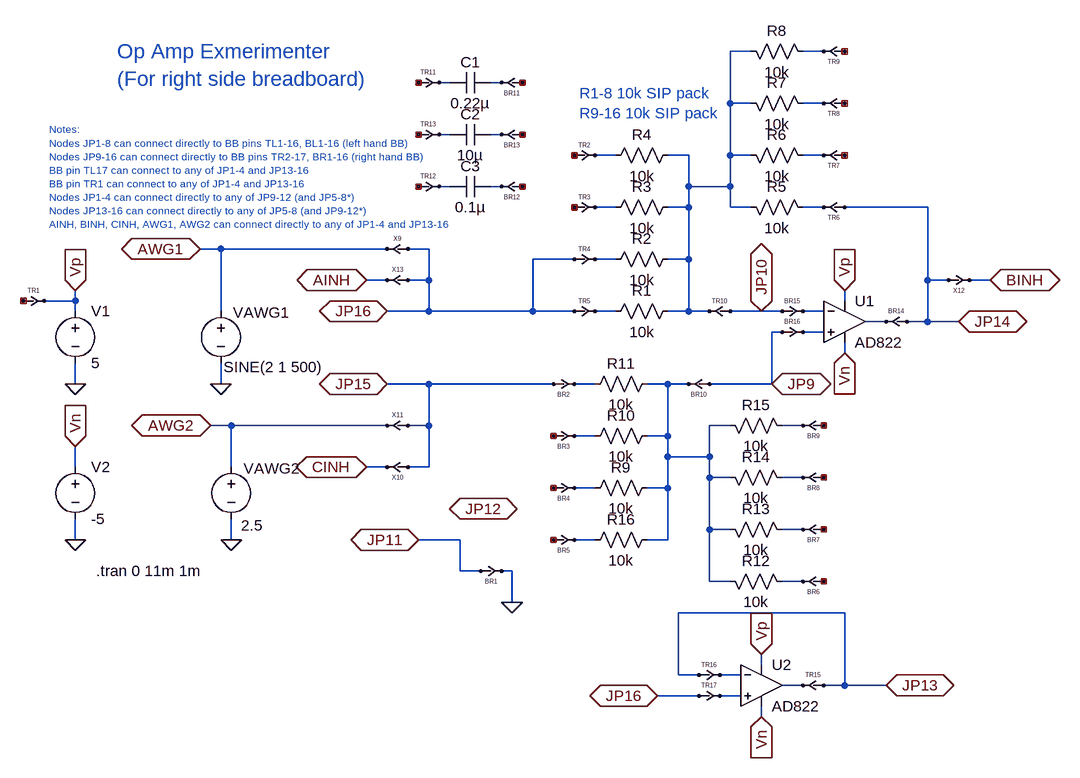
[diagram p0: schematic op_amp_experimenter.asc]
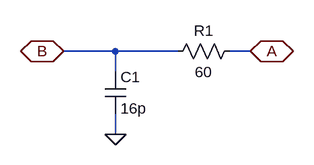
[diagram p1: sub-circuit cross_point.asc]
op_amp_experimenter.asc, the LTspice schematic file:
Version 4
SHEET 1 1668 1532
WIRE -720 416 -752 416
WIRE -608 416 -640 416
WIRE -1184 464 -1200 464
WIRE -1104 464 -1120 464
WIRE -752 496 -752 416
WIRE -720 496 -752 496
WIRE -608 496 -640 496
WIRE -1184 544 -1200 544
WIRE -1104 544 -1120 544
WIRE -928 576 -960 576
WIRE -816 576 -848 576
WIRE -752 576 -752 496
WIRE -720 576 -752 576
WIRE -608 576 -640 576
WIRE -1184 624 -1200 624
WIRE -1104 624 -1120 624
WIRE -816 624 -816 576
WIRE -752 624 -752 576
WIRE -752 624 -816 624
WIRE -928 656 -960 656
WIRE -816 656 -816 624
WIRE -816 656 -848 656
WIRE -752 656 -752 624
WIRE -720 656 -752 656
WIRE -608 656 -640 656
WIRE -448 656 -576 656
WIRE -1536 720 -1568 720
WIRE -1280 720 -1536 720
WIRE -1216 720 -1248 720
WIRE -992 736 -1056 736
WIRE -928 736 -960 736
WIRE -816 736 -816 656
WIRE -816 736 -848 736
WIRE -1280 768 -1312 768
WIRE -1216 768 -1216 720
WIRE -1216 768 -1248 768
WIRE -448 768 -448 656
WIRE -416 768 -448 768
WIRE -352 768 -384 768
WIRE -1760 800 -1760 784
WIRE -1760 800 -1808 800
WIRE -576 800 -576 784
WIRE -1760 816 -1760 800
WIRE -1536 816 -1536 720
WIRE -1216 816 -1216 768
WIRE -1216 816 -1280 816
WIRE -1056 816 -1056 736
WIRE -1056 816 -1216 816
WIRE -992 816 -1056 816
WIRE -928 816 -960 816
WIRE -816 816 -816 736
WIRE -816 816 -848 816
WIRE -784 816 -816 816
WIRE -704 816 -752 816
WIRE -672 816 -704 816
WIRE -608 816 -640 816
WIRE -512 832 -544 832
WIRE -448 832 -448 768
WIRE -448 832 -480 832
WIRE -400 832 -448 832
WIRE -672 848 -688 848
WIRE -608 848 -640 848
WIRE -576 880 -576 864
WIRE -1760 928 -1760 896
WIRE -1536 928 -1536 896
WIRE -1216 928 -1280 928
WIRE -1024 928 -1216 928
WIRE -960 928 -992 928
WIRE -848 928 -880 928
WIRE -816 928 -848 928
WIRE -688 928 -688 848
WIRE -688 928 -784 928
WIRE -1520 992 -1552 992
WIRE -1280 992 -1520 992
WIRE -1216 992 -1216 928
WIRE -1216 992 -1248 992
WIRE -752 992 -784 992
WIRE -640 992 -672 992
WIRE -960 1008 -992 1008
WIRE -848 1008 -848 928
WIRE -848 1008 -880 1008
WIRE -848 1040 -848 1008
WIRE -784 1040 -784 992
WIRE -784 1040 -848 1040
WIRE -1760 1056 -1760 1024
WIRE -1520 1056 -1520 992
WIRE -1280 1056 -1312 1056
WIRE -1216 1056 -1216 992
WIRE -1216 1056 -1248 1056
WIRE -784 1072 -784 1040
WIRE -752 1072 -784 1072
WIRE -640 1072 -672 1072
WIRE -960 1088 -992 1088
WIRE -848 1088 -848 1040
WIRE -848 1088 -880 1088
WIRE -784 1152 -784 1072
WIRE -752 1152 -784 1152
WIRE -640 1152 -672 1152
WIRE -1760 1168 -1760 1136
WIRE -1520 1168 -1520 1136
WIRE -1168 1168 -1232 1168
WIRE -960 1168 -992 1168
WIRE -848 1168 -848 1088
WIRE -848 1168 -880 1168
WIRE -1168 1216 -1168 1168
WIRE -1136 1216 -1168 1216
WIRE -1088 1216 -1104 1216
WIRE -784 1232 -784 1152
WIRE -752 1232 -784 1232
WIRE -640 1232 -672 1232
WIRE -1088 1264 -1088 1216
WIRE -576 1280 -832 1280
WIRE -704 1360 -704 1344
WIRE -832 1376 -832 1280
WIRE -800 1376 -832 1376
WIRE -736 1376 -768 1376
WIRE -640 1392 -672 1392
WIRE -576 1392 -576 1280
WIRE -576 1392 -608 1392
WIRE -512 1392 -576 1392
WIRE -800 1408 -864 1408
WIRE -736 1408 -768 1408
WIRE -704 1440 -704 1424
FLAG -512 1392 JP13
IOPIN -512 1392 BiDir
FLAG -864 1408 JP16
IOPIN -864 1408 BiDir
FLAG -400 832 JP14
IOPIN -400 832 BiDir
FLAG -1280 928 JP15
IOPIN -1280 928 BiDir
FLAG -688 928 JP9
IOPIN -688 928 BiDir
FLAG -704 816 JP10
IOPIN -704 816 BiDir
FLAG -1280 816 JP16
IOPIN -1280 816 BiDir
FLAG -1232 1168 JP11
IOPIN -1232 1168 BiDir
FLAG -1184 1120 JP12
IOPIN -1184 1120 BiDir
FLAG -1568 720 AWG1
IOPIN -1568 720 BiDir
FLAG -1312 1056 CINH
IOPIN -1312 1056 BiDir
FLAG -1552 992 AWG2
IOPIN -1552 992 BiDir
FLAG -352 768 BINH
IOPIN -352 768 BiDir
FLAG -1312 768 AINH
IOPIN -1312 768 BiDir
FLAG -1088 1264 0
FLAG -1760 928 0
FLAG -1760 1168 0
FLAG -1760 784 Vp
IOPIN -1760 784 In
FLAG -1760 1024 Vn
IOPIN -1760 1024 In
FLAG -704 1440 Vn
IOPIN -704 1440 In
FLAG -576 880 Vn
IOPIN -576 880 In
FLAG -704 1344 Vp
IOPIN -704 1344 In
FLAG -576 784 Vp
IOPIN -576 784 In
FLAG -1536 928 0
FLAG -1520 1168 0
SYMBOL cross_point -624 1392 R0
SYMATTR InstName TR15
SYMBOL cross_point -496 832 R0
SYMATTR InstName BR14
SYMBOL cross_point -784 1376 M0
SYMATTR InstName TR16
SYMBOL cross_point -784 1408 M0
SYMATTR InstName TR17
SYMBOL cross_point -656 816 M0
SYMATTR InstName BR15
SYMBOL cross_point -656 848 M0
SYMATTR InstName BR16
SYMBOL cross_point -1264 720 R0
SYMATTR InstName X9
SYMBOL cross_point -1264 1056 M180
SYMATTR InstName X10
SYMBOL cross_point -1264 992 R0
SYMATTR InstName X11
SYMBOL cross_point -400 768 R180
SYMATTR InstName X12
SYMBOL cross_point -1264 768 R0
SYMATTR InstName X13
SYMBOL res -832 800 R90
WINDOW 0 0 56 VBottom 2
WINDOW 3 32 56 VTop 2
SYMATTR InstName R1
SYMATTR Value 10k
SYMBOL res -832 720 R90
WINDOW 0 0 56 VBottom 2
WINDOW 3 32 56 VTop 2
SYMATTR InstName R2
SYMATTR Value 10k
SYMBOL res -832 640 R90
WINDOW 0 0 56 VBottom 2
WINDOW 3 32 56 VTop 2
SYMATTR InstName R3
SYMATTR Value 10k
SYMBOL res -832 560 R90
WINDOW 0 0 56 VBottom 2
WINDOW 3 32 56 VTop 2
SYMATTR InstName R4
SYMATTR Value 10k
SYMBOL res -736 640 M90
WINDOW 0 0 56 VBottom 2
WINDOW 3 32 56 VTop 2
SYMATTR InstName R5
SYMATTR Value 10k
SYMBOL res -736 560 M90
WINDOW 0 0 56 VBottom 2
WINDOW 3 32 56 VTop 2
SYMATTR InstName R6
SYMATTR Value 10k
SYMBOL res -736 480 M90
WINDOW 0 0 56 VBottom 2
WINDOW 3 32 56 VTop 2
SYMATTR InstName R7
SYMATTR Value 10k
SYMBOL res -736 400 M90
WINDOW 0 0 56 VBottom 2
WINDOW 3 32 56 VTop 2
SYMATTR InstName R8
SYMATTR Value 10k
SYMBOL cross_point -768 816 R0
SYMATTR InstName TR10
SYMBOL cross_point -976 576 M0
SYMATTR InstName TR2
SYMBOL cross_point -976 656 M0
SYMATTR InstName TR3
SYMBOL cross_point -976 736 M0
SYMATTR InstName TR4
SYMBOL cross_point -976 816 M0
SYMATTR InstName TR5
SYMBOL cross_point -592 656 M180
SYMATTR InstName TR6
SYMBOL cross_point -592 576 M180
SYMATTR InstName TR7
SYMBOL cross_point -592 496 M180
SYMATTR InstName TR8
SYMBOL cross_point -592 416 M180
SYMATTR InstName TR9
SYMBOL res -864 1072 R90
WINDOW 0 0 56 VBottom 2
WINDOW 3 32 56 VTop 2
SYMATTR InstName R9
SYMATTR Value 10k
SYMBOL res -864 992 R90
WINDOW 0 0 56 VBottom 2
WINDOW 3 32 56 VTop 2
SYMATTR InstName R10
SYMATTR Value 10k
SYMBOL res -864 912 R90
WINDOW 0 0 56 VBottom 2
WINDOW 3 32 56 VTop 2
SYMATTR InstName R11
SYMATTR Value 10k
SYMBOL res -768 1216 M90
WINDOW 0 0 56 VBottom 2
WINDOW 3 32 56 VTop 2
SYMATTR InstName R12
SYMATTR Value 10k
SYMBOL res -768 1136 M90
WINDOW 0 0 56 VBottom 2
WINDOW 3 32 56 VTop 2
SYMATTR InstName R13
SYMATTR Value 10k
SYMBOL res -768 1056 M90
WINDOW 0 0 56 VBottom 2
WINDOW 3 32 56 VTop 2
SYMATTR InstName R14
SYMATTR Value 10k
SYMBOL res -768 976 M90
WINDOW 0 0 56 VBottom 2
WINDOW 3 32 56 VTop 2
SYMATTR InstName R15
SYMATTR Value 10k
SYMBOL res -864 1152 R90
WINDOW 0 0 56 VBottom 2
WINDOW 3 32 56 VTop 2
SYMATTR InstName R16
SYMATTR Value 10k
SYMBOL cross_point -1120 1216 R180
SYMATTR InstName BR1
SYMBOL cross_point -1008 928 R180
SYMATTR InstName BR2
SYMBOL cross_point -1008 1008 R180
SYMATTR InstName BR3
SYMBOL cross_point -1008 1088 R180
SYMATTR InstName BR4
SYMBOL cross_point -1008 1168 R180
SYMATTR InstName BR5
SYMBOL cross_point -624 1232 M180
SYMATTR InstName BR6
SYMBOL cross_point -624 1152 M180
SYMATTR InstName BR7
SYMBOL cross_point -624 1072 M180
SYMATTR InstName BR8
SYMBOL cross_point -624 992 M180
SYMATTR InstName BR9
SYMBOL cross_point -800 928 M180
SYMATTR InstName BR10
SYMBOL cap -1120 448 R90
WINDOW 0 0 32 VBottom 2
WINDOW 3 32 32 VTop 2
SYMATTR InstName C1
SYMATTR Value 0.22µ
SYMBOL voltage -1760 800 R0
WINDOW 123 0 0 Left 0
WINDOW 39 0 0 Left 0
SYMATTR InstName V1
SYMATTR Value 5
SYMBOL voltage -1760 1040 R0
WINDOW 123 0 0 Left 0
WINDOW 39 0 0 Left 0
SYMATTR InstName V2
SYMATTR Value -5
SYMBOL voltage -1536 800 M0
WINDOW 123 0 0 Left 0
WINDOW 39 0 0 Left 0
WINDOW 0 -105 18 Left 2
WINDOW 3 -157 102 Left 2
SYMATTR InstName VAWG1
SYMATTR Value SINE(2 1 500)
SYMBOL voltage -1520 1040 M0
WINDOW 123 0 0 Left 0
WINDOW 39 0 0 Left 0
WINDOW 0 -105 18 Left 2
WINDOW 3 -49 106 Left 2
SYMATTR InstName VAWG2
SYMATTR Value 2.5
SYMBOL OpAmps\\AD822 -704 1328 R0
SYMATTR InstName U2
SYMBOL OpAmps\\AD822 -576 768 R0
SYMATTR InstName U1
SYMBOL cross_point -1216 464 M0
SYMATTR InstName TR11
SYMBOL cross_point -1088 464 M180
SYMATTR InstName BR11
SYMBOL cap -1120 528 R90
WINDOW 0 0 32 VBottom 2
WINDOW 3 32 32 VTop 2
SYMATTR InstName C2
SYMATTR Value 10µ
SYMBOL cross_point -1216 544 M0
SYMATTR InstName TR13
SYMBOL cross_point -1088 544 M180
SYMATTR InstName BR13
SYMBOL cap -1120 608 R90
WINDOW 0 0 32 VBottom 2
WINDOW 3 32 32 VTop 2
SYMATTR InstName C3
SYMATTR Value 0.1µ
SYMBOL cross_point -1216 624 M0
SYMATTR InstName TR12
SYMBOL cross_point -1088 624 M180
SYMATTR InstName BR12
SYMBOL cross_point -1824 800 M0
SYMATTR InstName TR1
TEXT -1728 1216 Left 2 !.tran 0 11m 1m
TEXT -1696 416 Left 3 ;Op Amp Exmerimenter\n(For right side breadboard)
TEXT -984 480 Left 2 ;R1-8 10k SIP pack\nR9-16 10k SIP pack
TEXT -1800 536 Left 1 ;Notes:\nNodes JP1-8 can connect directly to BB pins TL1-16, BL1-16 (left hand BB)\nNodes JP9-16 can connect directly to BB pins TR2-17, BR1-16 (right hand BB)\nBB pin TL17 can connect to any of JP1-4 and JP13-16\nBB pin TR1 can connect to any of JP1-4 and JP13-16\nNodes JP1-4 can connect directly to any of JP9-12 (and JP5-8*)\nNodes JP13-16 can connect directly to any of JP5-8 (and JP9-12*)\nAINH, BINH, CINH, AWG1, AWG2 can connect directly to any of JP1-4 and JP13-16

cross_point.asc, the sub-circuit schematic file:
Version 4
SHEET 1 880 680
WIRE 80 160 0 160
WIRE 176 160 80 160
WIRE 288 160 256 160
WIRE 80 192 80 160
WIRE 80 288 80 256
FLAG 288 160 A
IOPIN 288 160 BiDir
FLAG 0 160 B
IOPIN 0 160 BiDir
FLAG 80 288 0
SYMBOL res 272 144 R90
WINDOW 0 0 56 VBottom 2
WINDOW 3 32 56 VTop 2
SYMATTR InstName R1
SYMATTR Value 60
SYMBOL cap 64 192 R0
SYMATTR InstName C1
SYMATTR Value 16p

The netlist it stands for:
* op_amp_experimenter.asc
XTR15 JP13 N029 cross_point
XBR14 JP14 N017 cross_point
XTR16 JP13 N028 cross_point
XTR17 JP16 N030 cross_point
XBR15 JP10 N016 cross_point
XBR16 JP9 N018 cross_point
XX9 JP16 AWG1 cross_point
XX10 JP15 CINH cross_point
XX11 JP15 AWG2 cross_point
XX12 JP14 BINH cross_point
XX13 JP16 AINH cross_point
R1 N001 N015 10k
R2 N001 N014 10k
R3 N001 N012 10k
R4 N001 N008 10k
R5 N001 N013 10k
R6 N001 N009 10k
R7 N001 N005 10k
R8 N001 N002 10k
XTR10 JP10 N001 cross_point
XTR2 NC_01 N008 cross_point
XTR3 NC_02 N012 cross_point
XTR4 JP16 N014 cross_point
XTR5 JP16 N015 cross_point
XTR6 JP14 N013 cross_point
XTR7 NC_03 N009 cross_point
XTR8 NC_04 N005 cross_point
XTR9 NC_05 N002 cross_point
R9 N020 N024 10k
R10 N020 N022 10k
R11 N020 N019 10k
R12 N020 N027 10k
R13 N020 N025 10k
R14 N020 N023 10k
R15 N020 N021 10k
R16 N020 N026 10k
XBR1 JP11 0 cross_point
XBR2 JP15 N019 cross_point
XBR3 NC_06 N022 cross_point
XBR4 NC_07 N024 cross_point
XBR5 NC_08 N026 cross_point
XBR6 NC_09 N027 cross_point
XBR7 NC_10 N025 cross_point
XBR8 NC_11 N023 cross_point
XBR9 NC_12 N021 cross_point
XBR10 JP9 N020 cross_point
C1 N004 N003 0.22µ
V1 Vp 0 5
V2 Vn 0 -5
VAWG1 AWG1 0 SINE(2 1 500)
VAWG2 AWG2 0 2.5
XU2 N030 N028 Vp Vn N029 AD822  ; pins In+ In- V+ V- OUT
XU1 N018 N016 Vp Vn N017 AD822  ; pins In+ In- V+ V- OUT
XTR11 NC_13 N003 cross_point
XBR11 NC_14 N004 cross_point
C2 N007 N006 10µ
XTR13 NC_15 N006 cross_point
XBR13 NC_16 N007 cross_point
C3 N011 N010 0.1µ
XTR12 NC_17 N010 cross_point
XBR12 NC_18 N011 cross_point
XTR1 NC_19 Vp cross_point

* block symbol definitions
.subckt cross_point A B
R1 A B 60
C1 B 0 16p
.ends cross_point

.tran 0 11m 1m
* Op Amp Exmerimenter
* (For right side breadboard)
* R1-8 10k SIP pack
* R9-16 10k SIP pack
* Notes:
* Nodes JP1-8 can connect directly to BB pins TL1-16, BL1-16 (left hand BB)
* Nodes JP9-16 can connect directly to BB pins TR2-17, BR1-16 (right hand BB)
* BB pin TL17 can connect to any of JP1-4 and JP13-16
* BB pin TR1 can connect to any of JP1-4 and JP13-16
* Nodes JP1-4 can connect directly to any of JP9-12 (and JP5-8*)
* Nodes JP13-16 can connect directly to any of JP5-8 (and JP9-12*)
* AINH, BINH, CINH, AWG1, AWG2 can connect directly to any of JP1-4 and JP13-16
.backanno
.end